# EAGLE design realtalker (EAGLE 7.1.0)
COMPANY_NAME: Mark J. Blair, NF6X; DOCUMENT_ID: CoCoEPROMpak_v1.0; REV: 1.0
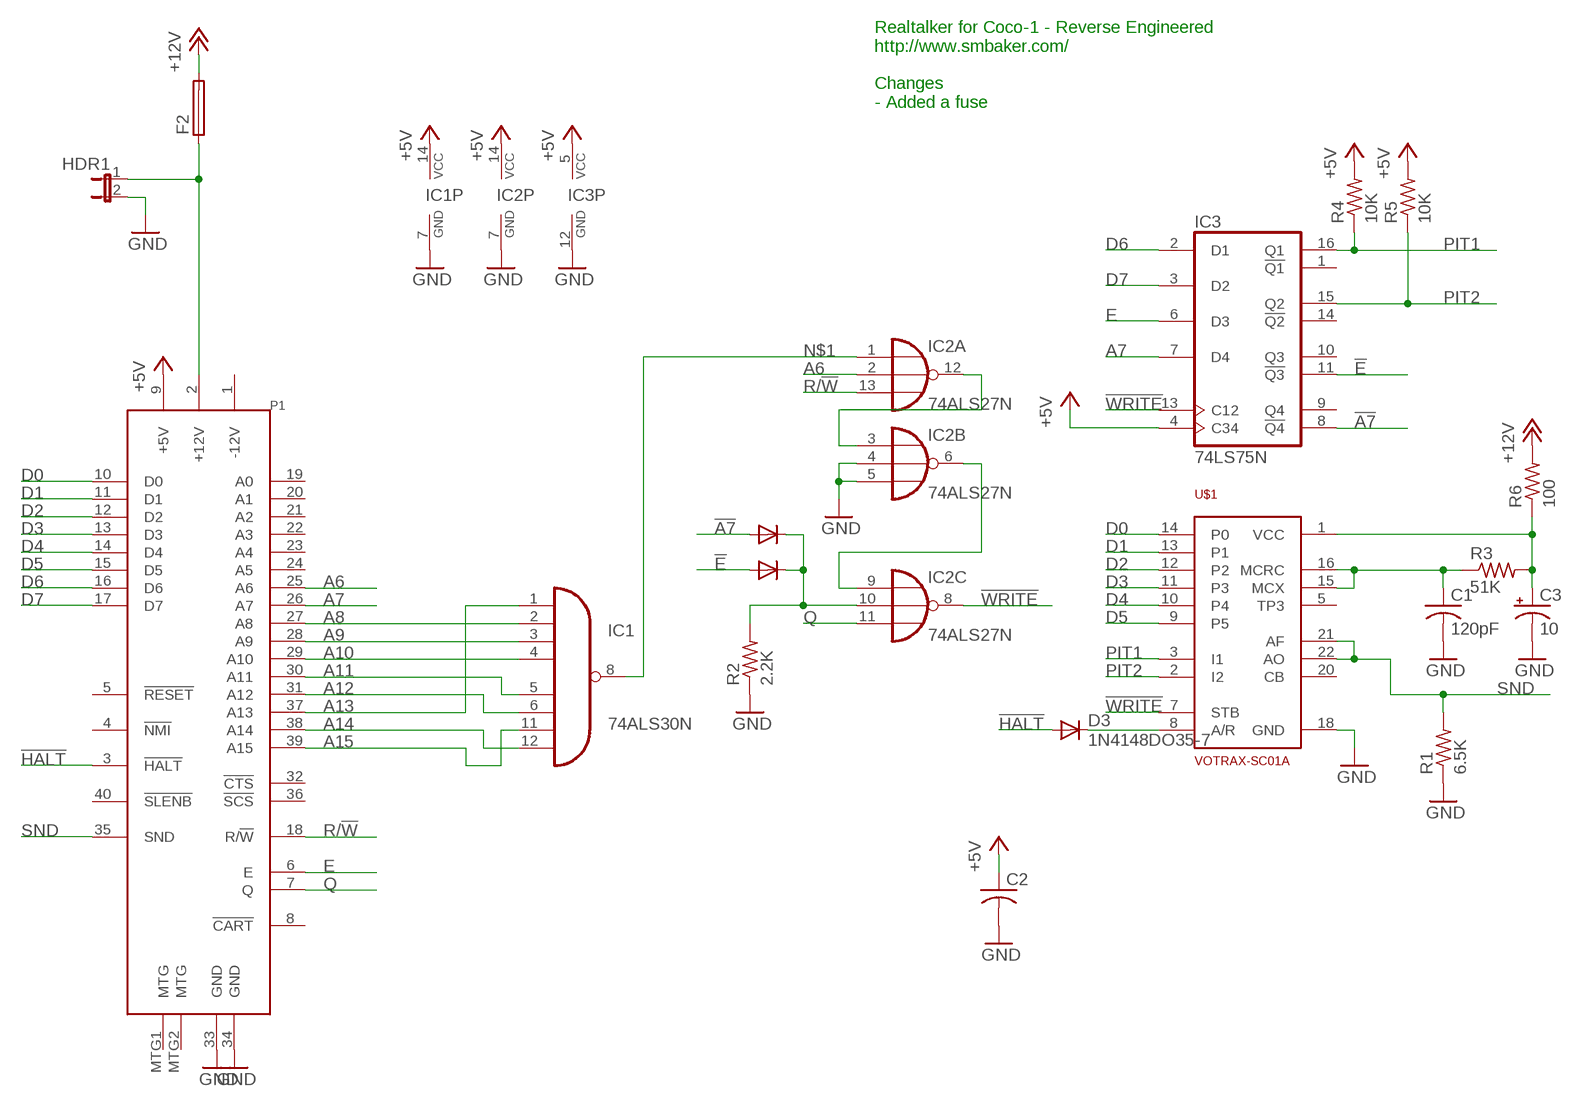
[diagram p0: schematic, sheet 1]

## Parts
C1  120pF  C-US025-025X050  [C025-025X050]
C2  C-US025-025X050  [C025-025X050]
C3  10  CPOL-USE2.5-6  [E2,5-6]
D1  1N4148DO35-7  [DO35-7]
D2  1N4148DO35-7  [DO35-7]
D3  1N4148DO35-7  [DO35-7]
F2  PTC_FUSE  [PTC_0.400]
HDR1  JP1E  [JP1]
IC1  74ALS30N  [DIL14]
IC2  74ALS27N  [DIL14]
IC3  74LS75N  [DIL16]
P1  COCO-CARTRT  [COCO-CART-RT]
R1  6.5K  R-US_0204/7  [0204/7]
R2  2.2K  R-US_0204/7  [0204/7]
R3  51K  R-US_0204/7  [0204/7]
R4  10K  R-US_0204/7  [0204/7]
R5  10K  R-US_0204/7  [0204/7]
R6  100  R-US_0204/7  [0204/7]
U$1  VOTRAX-SC01A  [DIL22-4]

## Nets
!A7: D2.A IC3.8(!Q4)
!E: D1.A IC3.11(!Q3)
!HALT: D3.A P1.3(!HALT)
!WRITE: IC2.8(C:O) IC3.13(C12) U$1.7(STB)
+5V [PWR]: C2.1 IC1.14(VCC) IC2.14(P:VCC) IC3.4(C34) IC3.5(VCC) P1.9(+5V) R4.2 R5.2
+12V [PWR]: F2.2 R6.2
A6: IC2.2(A:I1) P1.25(A6)
A7: IC3.7(D4) P1.26(A7)
A8: IC1.2(I1) P1.27(A8)
A9: IC1.3(I2) P1.28(A9)
A10: IC1.4(I3) P1.29(A10)
A11: IC1.5(I4) P1.30(A11)
A12: IC1.6(I5) P1.31(A12)
A13: IC1.1(I0) P1.37(A13)
A14: IC1.12(I7) P1.38(A14)
A15: IC1.11(I6) P1.39(A15)
D0: P1.10(D0) U$1.14(P0)
D1: P1.11(D1) U$1.13(P1)
D2: P1.12(D2) U$1.12(P2)
D3: P1.13(D3) U$1.11(P3)
D4: P1.14(D4) U$1.10(P4)
D5: P1.15(D5) U$1.9(P5)
D6: IC3.2(D1) P1.16(D6)
D7: IC3.3(D2) P1.17(D7)
E: IC3.6(D3) P1.6(E)
GND: C1.2 C2.2 C3.- HDR1.2 IC1.7(GND) IC2.4(B:I1) IC2.5(B:I2) IC2.7(P:GND) IC3.12(GND) P1.33(GND) P1.34(GND) R1.1 R2.1 U$1.18(GND)
N$1: IC1.8(O) IC2.1(A:I0)
N$2: D3.C U$1.8(A/R)
N$3: C1.1 R3.1 U$1.15(MCX) U$1.16(MCRC)
N$4 [PWR]: F2.1 HDR1.1 P1.2(+12V)
N$5: C3.+ R3.2 R6.1 U$1.1(VCC)
N$6: IC2.3(B:I0) IC2.12(A:O)
N$7: IC2.6(B:O) IC2.9(C:I0)
N$8: D1.C D2.C IC2.10(C:I1) R2.2
PIT1: IC3.16(Q1) R4.1 U$1.3(I1)
PIT2: IC3.15(Q2) R5.1 U$1.2(I2)
Q: IC2.11(C:I2) P1.7(Q)
R/!W: IC2.13(A:I2) P1.18(R/!W)
SND: P1.35(SND) R1.2 U$1.21(AF) U$1.22(AO)
Unconnected: IC3.1(!Q1) IC3.9(Q4) IC3.10(Q3) IC3.14(!Q2) P1.1(-12V) P1.4(!NMI) P1.5(!RESET) P1.8(!CART) P1.19(A0) P1.20(A1) P1.21(A2) P1.22(A3) P1.23(A4) P1.24(A5) P1.32(!CTS) P1.36(!SCS) P1.40(!SLENB) P1.MTG1(MTG) P1.MTG2(MTG) U$1.5(TP3) U$1.20(CB)

## Notes on the sheet
- Realtalker for Coco-1 - Reverse Engineered
  http://www.smbaker.com/
  
  Changes
  - Added a fuse

## Library data of the parts
C1 C2 = resistor:C-US: CAPACITOR, American symbol
C3 = resistor:CPOL-US: POLARIZED CAPACITOR, American symbol
D1-D3 = diode:1N4148: DIODE high speed (Philips)
F2 = scott:PTC_FUSE: PICOFUSE 19275, Wickmann; OC_FARNELL: unknown; OC_NEWARK: unknown
HDR1 = jumper:JP1E: JUMPER
IC1 = 74xx-eu:74*30: 8-input NAND gate
IC2 = 74xx-eu:74*27: Triple 3-input NOR gate
IC3 = 74xx-eu:74*75: 4-bit bistable LATCH
P1 = scott:COCO-CART: Tandy/TRS-80 Color Computer Cartridge Connector
R1-R6 = resistor:R-US_: RESISTOR, American symbol
U$1 = scott:VOTRAX-SC01A

## Net classes
0 default: width 0.254 mm, drill 0.254 mm
1 PWR: width 0.406 mm, clearance 0.254 mm

## Board
CoCoEPROMpak 4k-64k EPROM-based ROM cartridge for the Tandy/TRS-80 Color Computer. Copyright 2013 Mark J. Blair Distributed under GPLv3 https://github.com/NF6X/CoCoEPROMpak CoCoEPROMpak is a free hardware design: you can redistribute it and/or modify it under the terms of the GNU General Public License as published by the Free Software Foundation, either version 3 of the License, or (at your option) any later version. CoCoEPROMpak is distributed in the hope that it will be useful, but WITHOUT ANY WARRANTY; without even the implied warranty of MERCHANTABILITY or FITNESS FOR A PARTICULAR PURPOSE. See the GNU General Public License for more details. You should have received a copy of the GNU General Public License along with CoCoEPROMpak. If not, see .
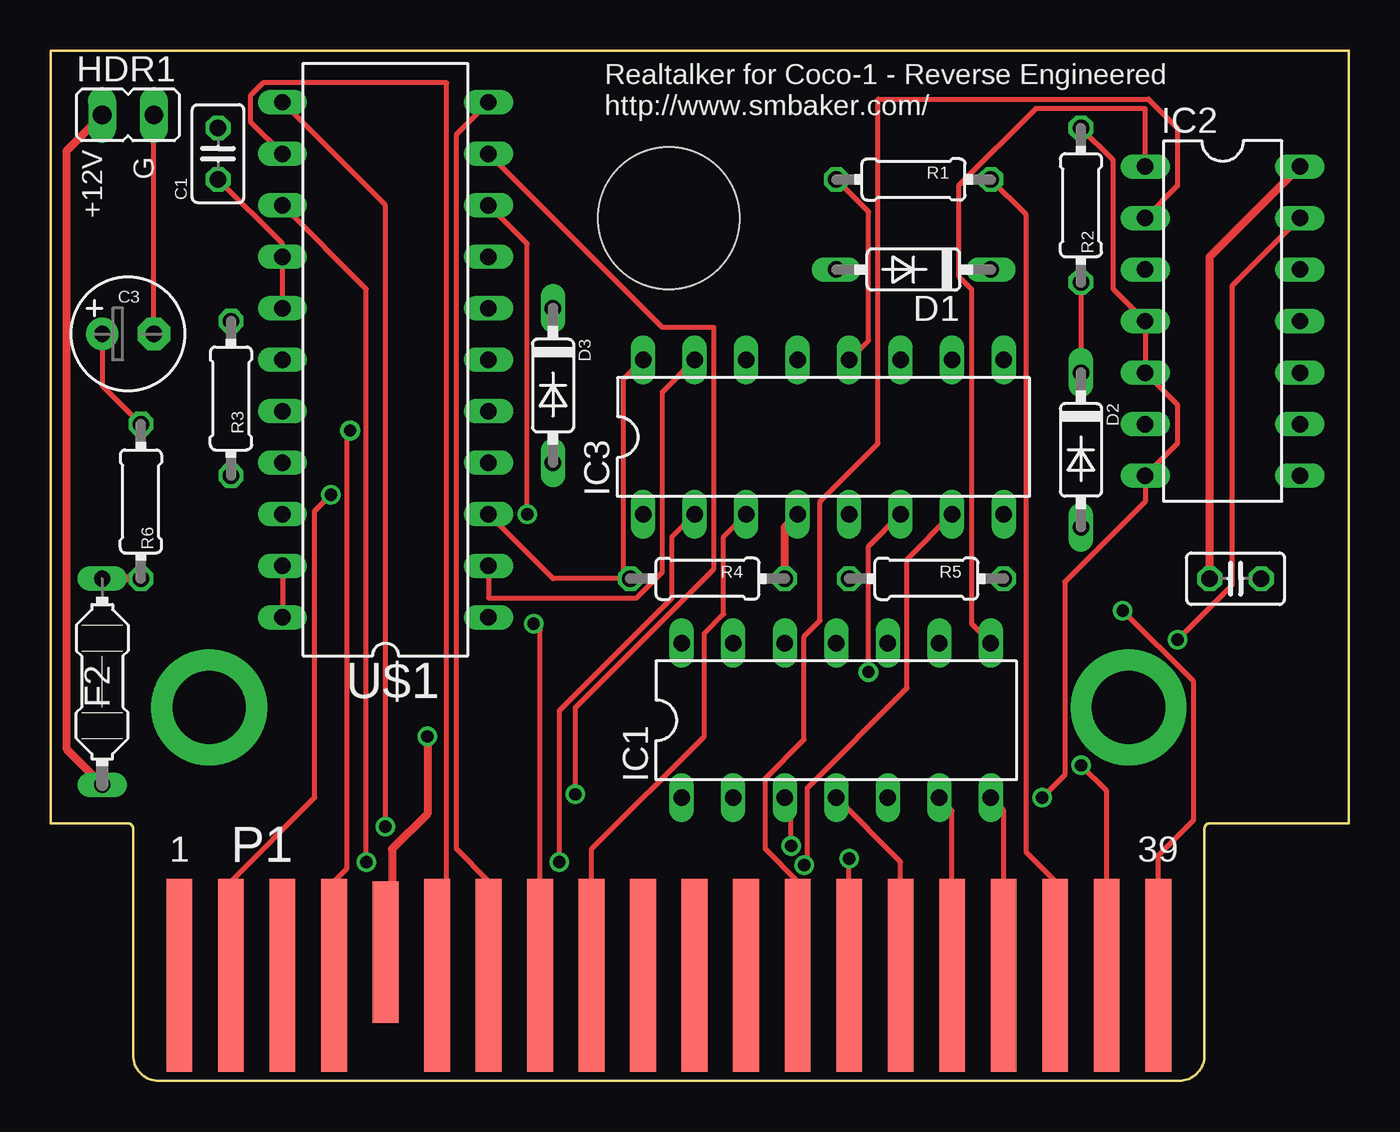
[diagram p1: board, top side]
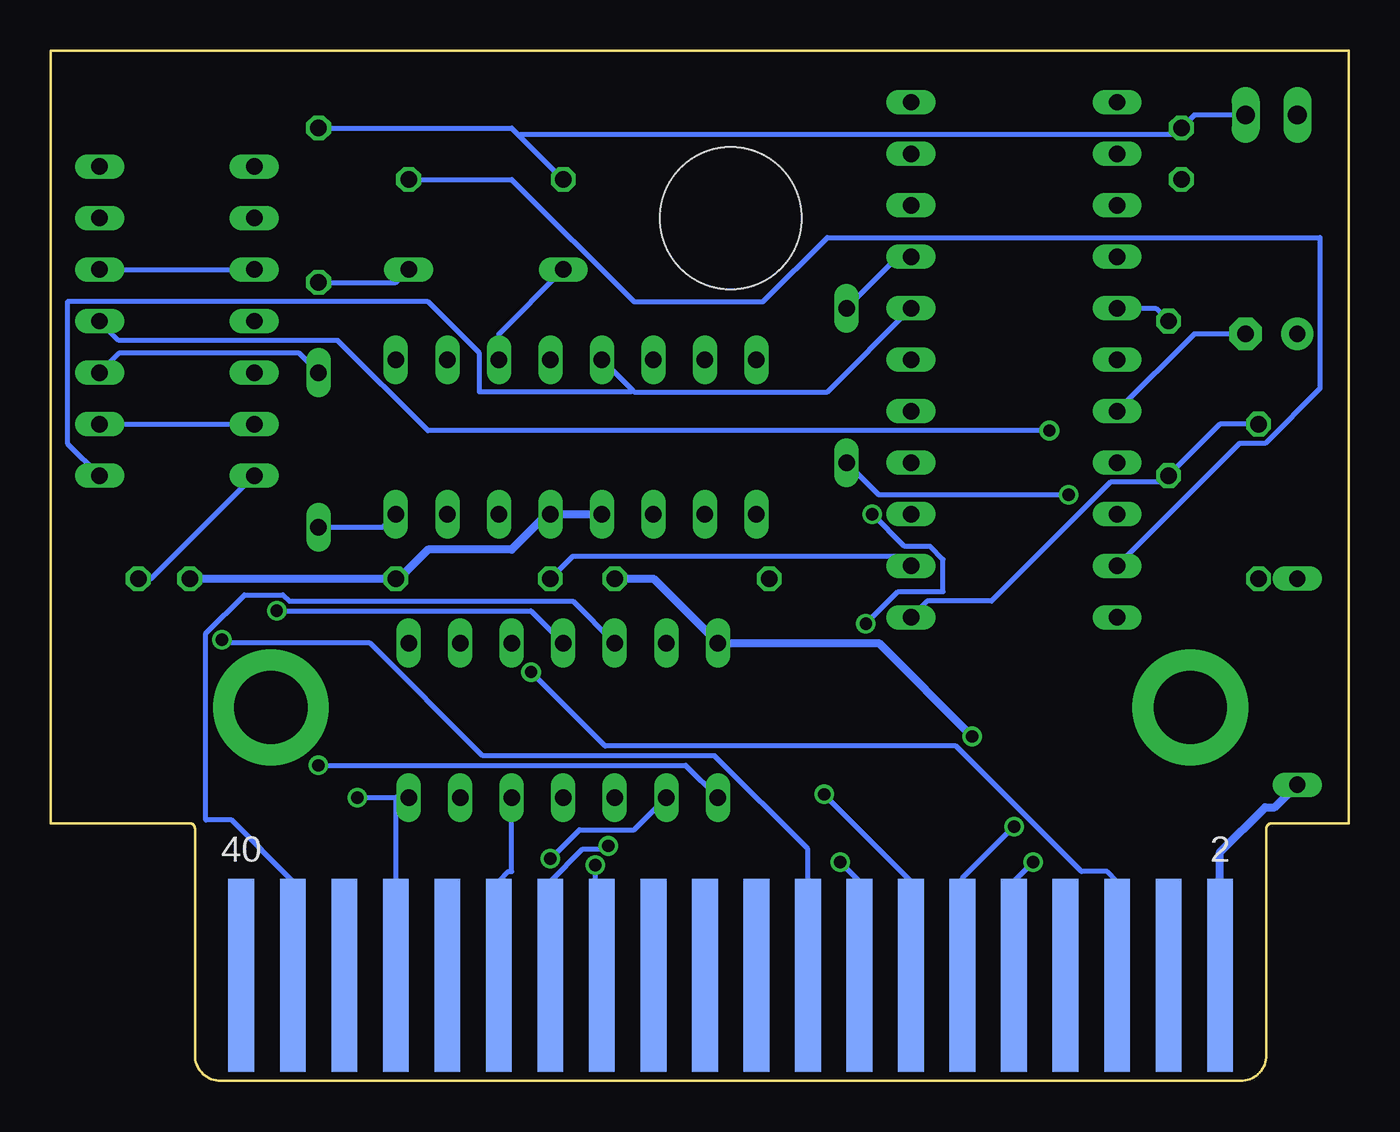
[diagram p2: board, bottom side, seen from below]

Size 64.01 x 50.8 mm. Coordinates in mm from the lower left corner, seen from the top.
Copper layers (1*16): Top 0.0356mm / dielectric 1.5011mm / Bottom 0.0356mm
Design rules "LaenPCBOrder *": minimum track width 10mil, minimum drill 24mil, track to track 6mil, track to pad 6mil, pad to pad 6mil, via to via 6mil, smd to smd 6mil, copper to edge 15mil, drill to drill 6mil, minimum pad ring 7mil, minimum via ring 7mil, stop-mask expansion 3mil, vias tented up to drill 25mil, thermal gap 10mil

### Footprints (pad centres in the part's own frame; a part is rotated, then mirrored left to right if it is on the bottom)
C025-025X050 = drill 0.813 octagon: 1 -1.27,0; 2 1.27,0
E2,5-6 = drill 0.813 pad 1.6: + -1.27,0 | drill 0.813 pad 1.6 octagon: - 1.27,0
DO35-7 = drill 0.813 long: A 3.81,0; C -3.81,0
PTC_0.400 = drill 0.813 long: 1 -5.08,0; 2 5.08,0
JP1 = drill 0.914 long: 1 0,-1.27; 2 0,1.27
DIL14 = drill 0.813 long: 1 -7.62,-3.81; 2 -5.08,-3.81; 3 -2.54,-3.81; 4 0,-3.81; 5 2.54,-3.81; 6 5.08,-3.81; 7 7.62,-3.81; 8 7.62,3.81; 9 5.08,3.81; 10 2.54,3.81; 11 0,3.81; 12 -2.54,3.81; 13 -5.08,3.81; 14 -7.62,3.81
DIL16 = drill 0.813 long: 1 -8.89,-3.81; 2 -6.35,-3.81; 3 -3.81,-3.81; 4 -1.27,-3.81; 5 1.27,-3.81; 6 3.81,-3.81; 7 6.35,-3.81; 8 8.89,-3.81; 9 8.89,3.81; 10 6.35,3.81; 11 3.81,3.81; 12 1.27,3.81; 13 -1.27,3.81; 14 -3.81,3.81; 15 -6.35,3.81; 16 -8.89,3.81
COCO-CART-RT = smd 1.27 x 9.525: 1 -24.13,5.207; 3 -21.59,5.207; 5 -19.05,5.207; 7 -16.51,5.207; 11 -11.43,5.207; 13 -8.89,5.207; 15 -6.35,5.207; 17 -3.81,5.207; 19 -1.27,5.207; 21 1.27,5.207; 23 3.81,5.207; 25 6.35,5.207; 27 8.89,5.207; 29 11.43,5.207; 31 13.97,5.207; 33 16.51,5.207; 35 19.05,5.207; 37 21.59,5.207; 39 24.13,5.207 | smd 1.27 x 9.525 bottom: 2 -24.13,5.207; 4 -21.59,5.207; 6 -19.05,5.207; 8 -16.51,5.207; 10 -13.97,5.207; 12 -11.43,5.207; 14 -8.89,5.207; 16 -6.35,5.207; 18 -3.81,5.207; 20 -1.27,5.207; 22 1.27,5.207; 24 3.81,5.207; 26 6.35,5.207; 28 8.89,5.207; 30 11.43,5.207; 32 13.97,5.207; 34 16.51,5.207; 36 19.05,5.207; 38 21.59,5.207; 40 24.13,5.207 | smd 1.27 x 6.985: 9 -13.97,6.35 | drill 3.607 pad 5.715: MTG1 -22.669,18.415; MTG2 22.669,18.415 | hole 6.985: 0,42.545
0204/7 = drill 0.813 octagon: 1 -3.81,0; 2 3.81,0
DIL22-4 = drill 0.813 long: 1 -12.7,-5.08; 2 -10.16,-5.08; 3 -7.62,-5.08; 4 -5.08,-5.08; 5 -2.54,-5.08; 6 0,-5.08; 7 2.54,-5.08; 8 5.08,-5.08; 9 7.62,-5.08; 10 10.16,-5.08; 11 12.7,-5.08; 12 12.7,5.08; 13 10.16,5.08; 14 7.62,5.08; 15 5.08,5.08; 16 2.54,5.08; 17 0,5.08; 18 -2.54,5.08; 19 -5.08,5.08; 20 -7.62,5.08; 21 -10.16,5.08; 22 -12.7,5.08

### Placement (x,y rotation side)
C1  8.26,45.72 90 top
C2  58.42,24.77 0 top
C3  3.81,36.83 0 top
D1  42.55,40.01 180 top
D2  50.8,31.11 270 top
D3  24.77,34.29 270 top
F2  2.54,19.68 90 top
HDR1  3.81,47.62 270 top
IC1  38.73,17.78 0 top
IC2  57.78,37.47 270 top
IC3  38.1,31.75 0 top
P1  30.48,0 0 top
R1  42.55,44.45 0 top
R2  50.8,43.18 270 top
R3  8.89,33.66 270 top
R4  32.38,24.77 0 top
R5  43.18,24.77 0 top
R6  4.45,28.57 270 top
U$1  16.51,35.56 90 top

### Tracks (layer width: path | path; a pad name or v marks a point on that pad's centre or on a via)
!A7
  Bottom 0.254: IC3.8 47.62,27.3 D2.A
!E
  Bottom 0.254: D1.A 41.91,36.83 IC3.11
!HALT  (via drill 0.61)
  Top 0.254: v13.81,28.89 13.02,28.1 13.02,13.97 8.89,9.84 P1.3
  Bottom 0.254: D3.A 23.18,28.89 v13.81,28.89
!WRITE
  Bottom 0.254: U$1.7 25.72,33.97 35.24,33.97 35.32,34.05 | IC3.13 35.32,34.05 | IC2.8 63.18,31.43 63.18,38.42 45.4,38.42 42.86,35.88 42.86,33.97 35.4,33.97 35.32,34.05
+5V  (via drill 0.61)
  Top 0.406: IC2.14 57.15,40.64 C2.1 | IC3.4 36.2,27.3 R4.2 | P1.9 16.83,6.67 16.83,11.43 18.57,13.18 v18.57,16.99
  Bottom 0.406: C2.1 R5.2 46.83,24.77 45.4,26.19 41.27,26.19 39.53,27.94 IC3.5 IC3.4 | R4.2 34.29,24.77 IC1.14 23.18,21.59 v18.57,16.99
+12V
  Top 0.406: R6.2 F2.2
A6
  Top 0.254: IC2.2 55.56,44.13 55.56,46.99 54.13,48.42 40.8,48.42 40.8,31.43 37.94,28.57 37.94,22.7 37.15,21.91 37.15,16.83 35.24,14.92 35.24,11.43 36.83,9.84 P1.25
A7  (via drill 0.61)
  Top 0.254: IC3.7 42.23,25.72 42.23,19.37 37.31,14.45 37.31,10.79 v37.15,10.64
  Bottom 0.254: v37.15,10.64 37.15,5.24 36.83,5.24 P1.26
A8  (via drill 0.61)
  Top 0.254: P1.27 v39.37,10.95
  Bottom 0.254: IC1.2 35.24,12.38 37.94,12.38 v39.37,10.95
A9  (via drill 0.61)
  Top 0.254: IC1.3 36.51,13.65 v36.51,11.59
  Bottom 0.254: v36.51,11.59 36.67,11.43 37.78,11.43 39.37,9.84 P1.28
A10
  Top 0.254: IC1.4 41.91,10.79 P1.29
A11
  Bottom 0.254: IC1.5 41.27,10.32 41.43,10.32 41.91,9.84 P1.30
A12
  Top 0.254: IC1.6 44.45,13.34 P1.31
A13  (via drill 0.61)
  Top 0.254: v50.8,15.56 52.07,14.29 P1.37
  Bottom 0.254: IC1.1 32.7,15.56 v50.8,15.56
A14
  Bottom 0.254: IC1.12 38.26,23.65 52.23,23.65 52.55,23.97 54.45,23.97 56.36,22.07 56.36,12.86 55.09,12.86 52.07,9.84 P1.38
A15  (via drill 0.61)
  Top 0.254: v52.86,23.18 56.36,19.68 56.36,12.86 54.61,11.11 P1.39
  Bottom 0.254: IC1.11 40.32,23.18 v52.86,23.18
D0  (via drill 0.61)
  Top 0.254: U$1.14 15.56,39.05 v15.56,10.79
  Bottom 0.254: v15.56,10.79 16.51,9.84 P1.10
D1
  Top 0.254: U$1.13 9.84,47.31 9.84,48.58 10.48,49.21 19.53,49.21 19.53,5.71 19.05,5.24 P1.11
D2  (via drill 0.61)
  Top 0.254: U$1.12 16.51,43.18 v16.51,12.54
  Bottom 0.254: v16.51,12.54 19.05,10 P1.12
D3
  Top 0.254: U$1.11 20,46.67 20,11.43 21.59,9.84 P1.13
D4  (via drill 0.61)
  Top 0.254: U$1.10 30.16,37.15 32.7,37.15 32.7,25.24 25.88,18.41 v25.88,14.13
  Bottom 0.254: v25.88,14.13 21.59,9.84 P1.14
D5  (via drill 0.61)
  Top 0.254: U$1.9 23.5,41.27 v23.5,27.94 | v23.81,22.54 24.13,22.23 P1.15
  Bottom 0.254: v23.5,27.94 21.91,26.35 20.64,26.35 20,25.72 20,24.13 22.23,24.13 v23.81,22.54
D6  (via drill 0.61)
  Top 0.254: IC3.2 30.64,26.83 30.64,23.81 25.08,18.26 v25.08,10.79
  Bottom 0.254: v25.08,10.79 24.13,9.84 P1.16
D7
  Top 0.254: IC3.3 33.18,26.83 33.18,23.02 32.23,22.07 32.23,16.99 26.67,11.43 P1.17
E  (via drill 0.61)
  Top 0.254: IC3.6 40.32,26.35 v40.32,20.16
  Bottom 0.254: v40.32,20.16 36.67,16.51 19.37,16.51 13.18,10.32 11.91,10.32 11.43,9.84 P1.6
GND  (via drill 0.61)
  Top 0.254: IC1.7 46.99,13.34 P1.34 | C3.- HDR1.2 | R1.1 40.32,42.86 40.32,36.51 IC3.12 | R2.1 52.39,45.4 52.39,39.05 IC2.4 IC2.5 55.56,33.34 55.56,31.43 IC2.7 53.98,28.57 50.01,24.61 50.01,15.08 v48.9,13.97
  Bottom 0.254: 46.99,13.97 P1.34 | IC1.7 46.99,13.97 | HDR1.2 7.62,47.62 C1.2 8.57,46.67 40.8,46.67 40.88,46.59 | U$1.18 7.62,36.83 C3.- | IC2.7 59.05,24.77 C2.2 | 40.88,46.59 41.27,46.99 R2.1 | 40.88,46.59 R1.1 | v48.9,13.97 46.99,13.97
N$1
  Top 0.254: IC1.8 45.4,22.54 45.4,39.05 44.77,39.69 44.77,44.13 48.58,47.94 53.98,47.94 IC2.1
N$2
  Bottom 0.254: D3.C 22.23,40.64 U$1.8
N$3
  Top 0.254: U$1.16 U$1.15 11.43,41.27 C1.1
  Bottom 0.254: R3.1 9.53,38.1 U$1.16
N$4
  Top 0.406: HDR1.1 0.79,45.88 0.79,16.35 F2.1
  Bottom 0.406: F2.1 3.65,13.49 4.13,13.49 6.35,11.27 P1.2
N$5
  Top 0.254: R6.1 2.54,34.29 C3.+
  Bottom 0.254: R6.1 6.35,32.38 R3.2 9.21,29.53 11.75,29.53 17.62,23.65 20.8,23.65 U$1.1
N$6
  Bottom 0.254: IC2.12 IC2.3
N$7
  Bottom 0.254: IC2.9 IC2.6
N$8
  Top 0.254: R2.2 D2.C
  Bottom 0.254: D1.C 46.99,39.37 R2.2 | IC2.10 60.64,35.88 51.75,35.88 D2.C
PIT1
  Top 0.254: U$1.3 24.77,24.77 28.26,24.77 | IC3.16 28.26,34.61 28.26,24.77 | 28.26,24.77 R4.1
PIT2
  Top 0.254: IC3.15 30.16,33.97 30.16,25.08 28.89,23.81 21.59,23.81 U$1.2
  Bottom 0.254: U$1.2 22.07,25.88 38.26,25.88 R5.1
Q  (via drill 0.61)
  Top 0.254: v14.76,32.07 14.61,31.91 14.61,10.48 13.97,9.84 P1.7
  Bottom 0.254: IC2.11 60.64,36.51 49.85,36.51 45.4,32.07 v14.76,32.07
R/!W  (via drill 0.61)
  Top 0.254: IC2.13 58.26,39.21 58.26,24.45 v55.56,21.75
  Bottom 0.254: v55.56,21.75 55.4,21.59 48.26,21.59 42.7,16.03 31.27,16.03 26.67,11.43 P1.18
SND
  Top 0.254: U$1.21 U$1.22 | R1.2 48.1,42.7 48.1,11.27 49.53,9.84 P1.35
  Bottom 0.254: U$1.21 5.4,31.43 4.13,31.43 1.43,34.13 1.43,41.59 25.72,41.59 28.89,38.42 35.24,38.42 41.27,44.45 R1.2

### Text on the board
tPlace: Realtalker for Coco-1 - Reverse Engineered / http://www.smbaker.com/ | G | +12V